# Altium schematic sheet Connectors.SchDoc
size A4
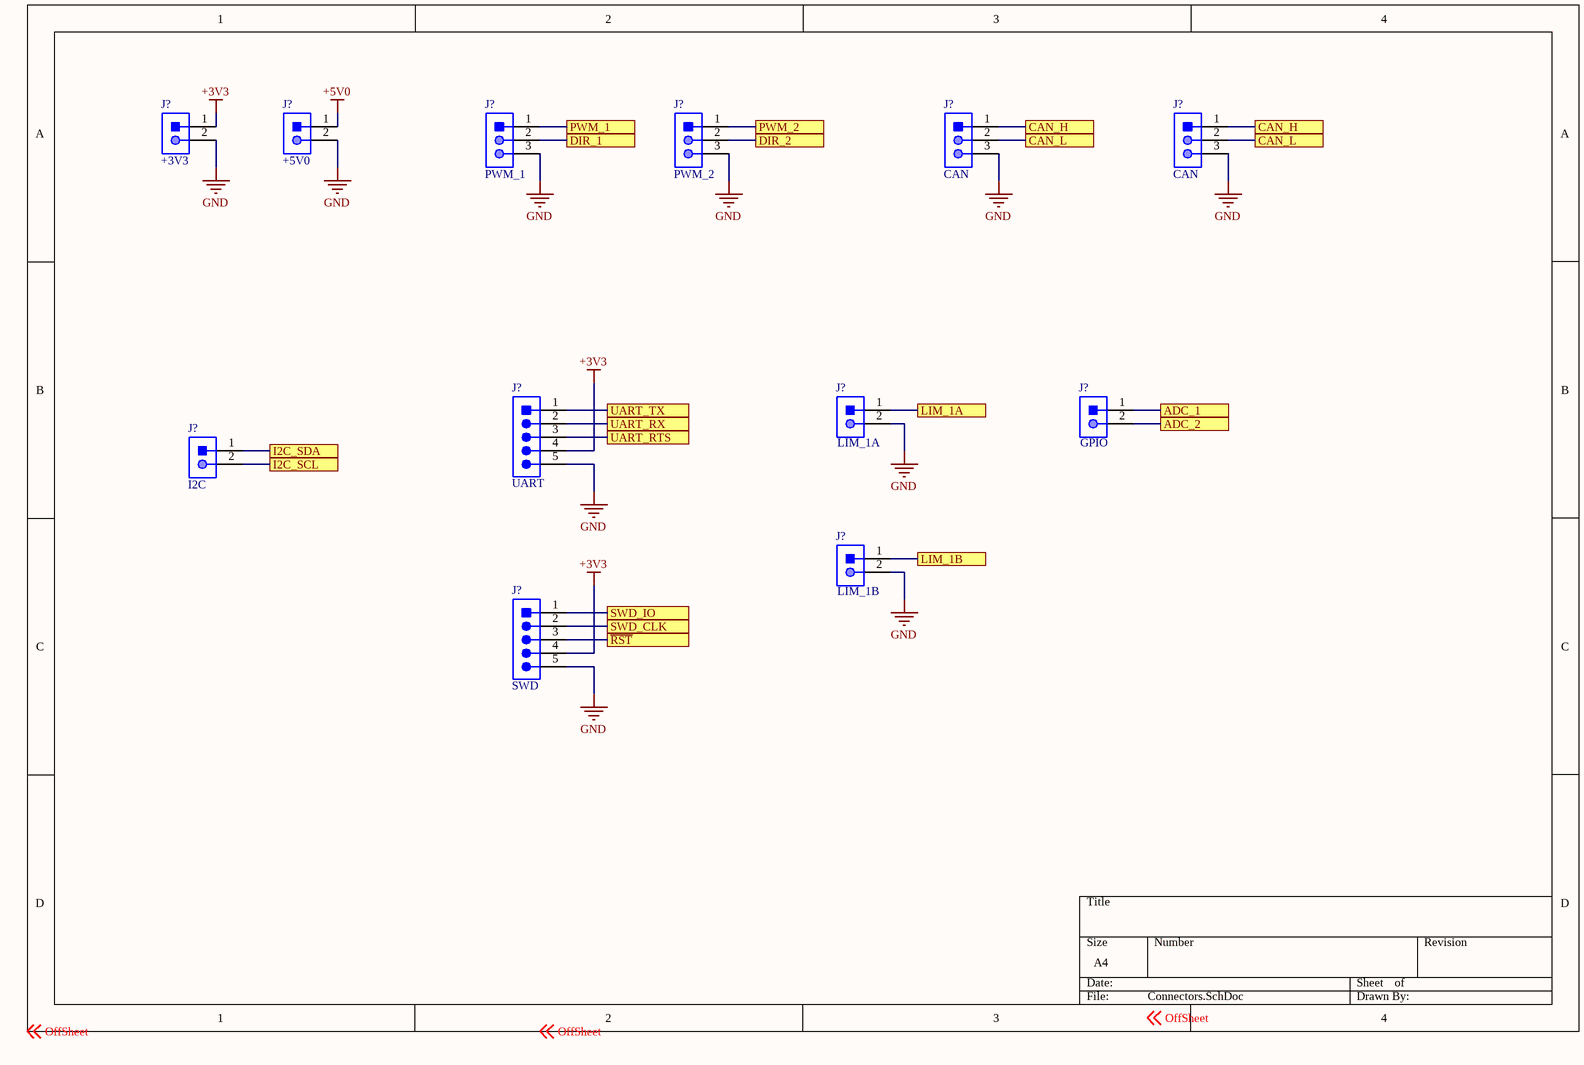
[diagram p0: Connectors.SchDoc]

## Parts
(Parts that share a designator on the sheet are numbered #1, #2 ... from top to bottom, then left to right.)
J?#1  +3V3
J?#2  +5V0
J?#3  PWM_1
J?#4  PWM_2
J?#5  CAN
J?#6  CAN
J?#7  UART
J?#8  LIM_1A
J?#9  GPIO
J?#10  I2C
J?#11  LIM_1B
J?#12  SWD

## Ports
ADC_1, ADC_2, CAN_H, CAN_L, DIR_1, DIR_2, I2C_SCL, I2C_SDA, LIM_1A, LIM_1B, PWM_1, PWM_2, SWD_CLK, SWD_IO, UART_RTS, UART_RX, UART_TX, ~{RST}

## Nets
+3V3: J?#1.1 J?#7.4 J?#12.4
+5V0: J?#2.1
GND: J?#1.2 J?#2.2 J?#3.3 J?#4.3 J?#5.3 J?#6.3 J?#7.5 J?#8.2 J?#11.2 J?#12.5
~{RST}: J?#12.3 ; port ~{RST}
ADC_1: J?#9.1 ; port ADC_1
ADC_2: J?#9.2 ; port ADC_2
CAN_H: J?#5.1 J?#6.1 ; port CAN_H
CAN_L: J?#5.2 J?#6.2 ; port CAN_L
DIR_1: J?#3.2 ; port DIR_1
DIR_2: J?#4.2 ; port DIR_2
I2C_SCL: J?#10.2 ; port I2C_SCL
I2C_SDA: J?#10.1 ; port I2C_SDA
LIM_1A: J?#8.1 ; port LIM_1A
LIM_1B: J?#11.1 ; port LIM_1B
PWM_1: J?#3.1 ; port PWM_1
PWM_2: J?#4.1 ; port PWM_2
SWD_CLK: J?#12.2 ; port SWD_CLK
SWD_IO: J?#12.1 ; port SWD_IO
UART_RTS: J?#7.3 ; port UART_RTS
UART_RX: J?#7.2 ; port UART_RX
UART_TX: J?#7.1 ; port UART_TX

## Notes on the sheet
- Labels drawn without touching a wire or pin: OffSheet

## Library data of the parts
J?#1 J?#2 J?#8-J?#11 = CON_2M_PH_SIDE_SMT: CONN HEADER PH SIDE 2POS 2MM SMD; Manufacturer: JST; Part Number: S2B-PH-SM4-TB; ComponentLink1Description: Datasheet; ComponentLink1URL: http://www.jst-mfg.com/product/pdf/eng/ePH.pdf
J?#3-J?#6 = CON_3M_PH_SIDE_SMT: CONN HEADER PH SIDE 3POS 2MM SMD; Manufacturer: JST; Part Number: B3B-PH-SM4-TB; ComponentLink1Description: Datasheet; ComponentLink1URL: http://www.jst-mfg.com/product/pdf/eng/ePH.pdf
J?#7 J?#12 = CON_5M_PH_SIDE_TH: CONN HEADER PH SIDE 5POS 2MM; Manufacturer: JST; Part Number: S5B-PH-K-S; ComponentLink1Description: Datasheet; ComponentLink1URL: http://www.jst-mfg.com/product/pdf/eng/ePH.pdf